# EAGLE design SparkRemoteInterface (EAGLE 6.6.0)
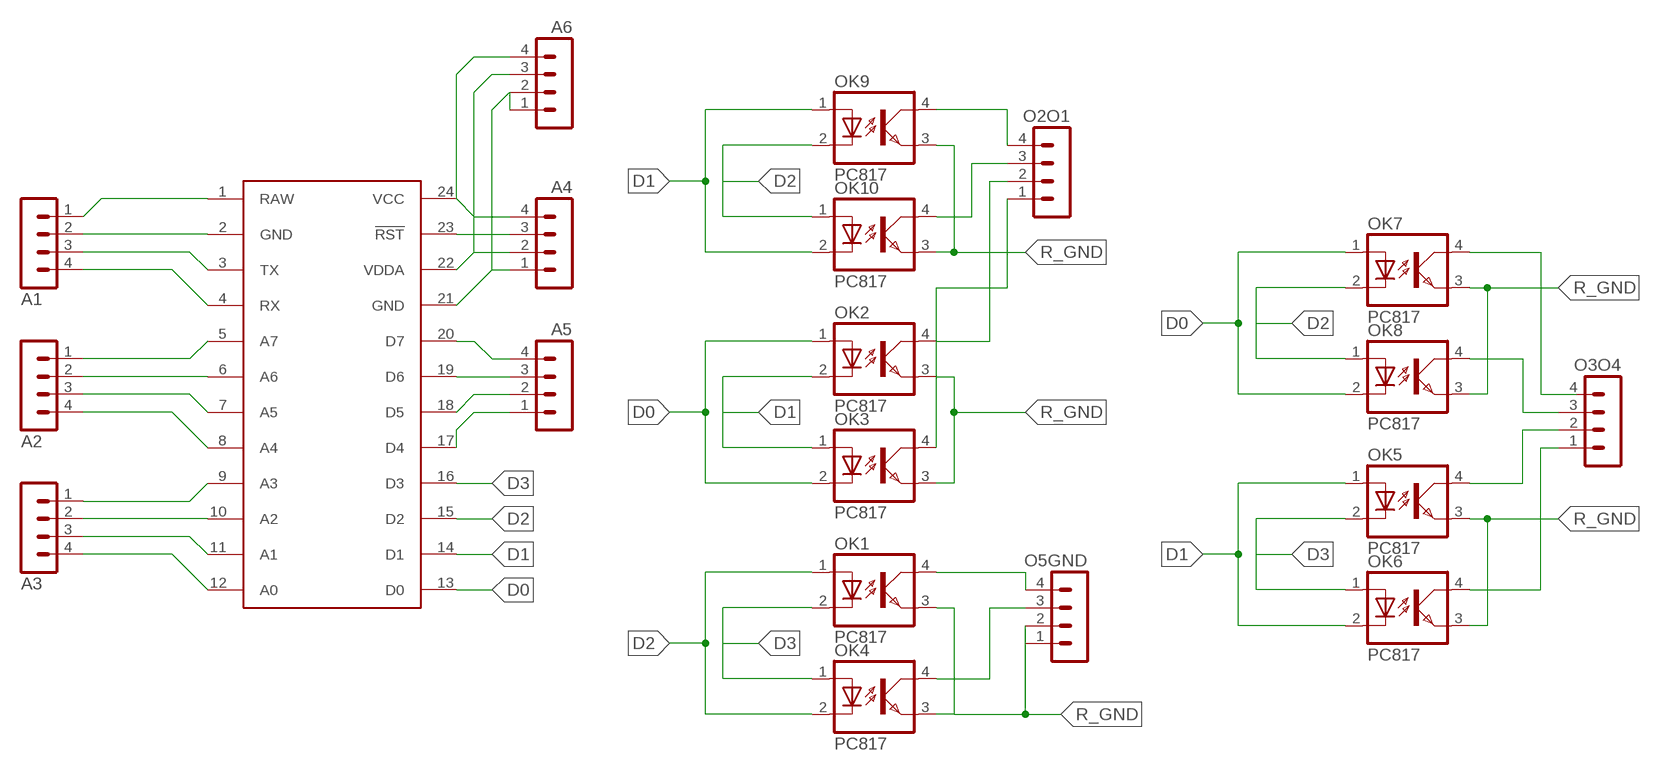
[diagram p0: schematic, sheet 1]

## Parts
A1  MA04-1  [MA04-1]
A2  MA04-1  [MA04-1]
A3  MA04-1  [MA04-1]
A4  MA04-1  [MA04-1]
A5  MA04-1  [MA04-1]
A6  MA04-1  [MA04-1]
O2O1  MA04-1  [MA04-1]
O3O4  MA04-1  [MA04-1]
O5GND  MA04-1  [MA04-1]
OK1  PC817  [DIL04]
OK2  PC817  [DIL04]
OK3  PC817  [DIL04]
OK4  PC817  [DIL04]
OK5  PC817  [DIL04]
OK6  PC817  [DIL04]
OK7  PC817  [DIL04]
OK8  PC817  [DIL04]
OK9  PC817  [DIL04]
OK10  PC817  [DIL04]
U$1  SPARK_CORECORE  [SPARK_CORE]

## Nets
1R: O2O1.2 OK2.4(COL)
1W: O2O1.1 OK3.4(COL)
2R: O2O1.4 OK9.4(COL)
2W: O2O1.3 OK10.4(COL)
3R: OK7.4(COL)
3W: O3O4.3 OK8.4(COL)
4R: O3O4.2 OK5.4(COL)
4W: O3O4.1 OK6.4(COL)
5R: O5GND.4 OK1.4(COL)
5W: O5GND.3 OK4.4(COL)
D0: OK2.1(A) OK3.2(C) OK7.1(A) OK8.2(C) U$1.13(D0)
D1: OK2.2(C) OK3.1(A) OK5.1(A) OK6.2(C) OK9.1(A) OK10.2(C) U$1.14(D1)
D2: OK1.1(A) OK4.2(C) OK7.2(C) OK8.1(A) OK9.2(C) OK10.1(A) U$1.15(D2)
D3: OK1.2(C) OK4.1(A) OK5.2(C) OK6.1(A) U$1.16(D3)
N$1: A1.1 U$1.1(RAW)
N$2: A3.1 U$1.9(A3)
N$3: A1.2 U$1.2(GND)
N$4: A1.3 U$1.3(TX)
N$5: A1.4 U$1.4(RX)
N$6: A2.1 U$1.5(A7)
N$16: A2.2 U$1.6(A6)
N$17: A2.3 U$1.7(A5)
N$18: A2.4 U$1.8(A4)
N$20: A3.2 U$1.10(A2)
N$21: A3.3 U$1.11(A1)
N$22: A3.4 U$1.12(A0)
N$23: A4.4 A6.4 U$1.24(VCC)
N$24: A4.3 U$1.23(!RST)
N$25: A4.2 A6.3 U$1.22(VDDA)
N$26: A4.1 A6.1 A6.2 U$1.21(GND)
N$27: A5.4 U$1.20(D7)
N$28: A5.3 U$1.19(D6)
N$29: A5.2 U$1.18(D5)
N$30: A5.1 U$1.17(D4)
R_GND: O5GND.1 O5GND.2 OK1.3(EMIT) OK2.3(EMIT) OK3.3(EMIT) OK4.3(EMIT) OK5.3(EMIT) OK6.3(EMIT) OK7.3(EMIT) OK8.3(EMIT) OK9.3(EMIT) OK10.3(EMIT)
Unconnected: O3O4.4

## Library data of the parts
A1-A6 O2O1 O3O4 O5GND = con-lstb:MA04-1: PIN HEADER; OC_FARNELL: unknown; OC_NEWARK: unknown
OK1-OK10 = optocoupler:PC817: SHARP OPTO COUPLER; MPN: PC817X4J000F; OC_FARNELL: 9707727; OC_NEWARK: 97K7059
U$1 = Spark:SPARK_CORE

## Net classes
0 default: width 0.305 mm, drill 0.508 mm, clearance 0.381 mm

## Board
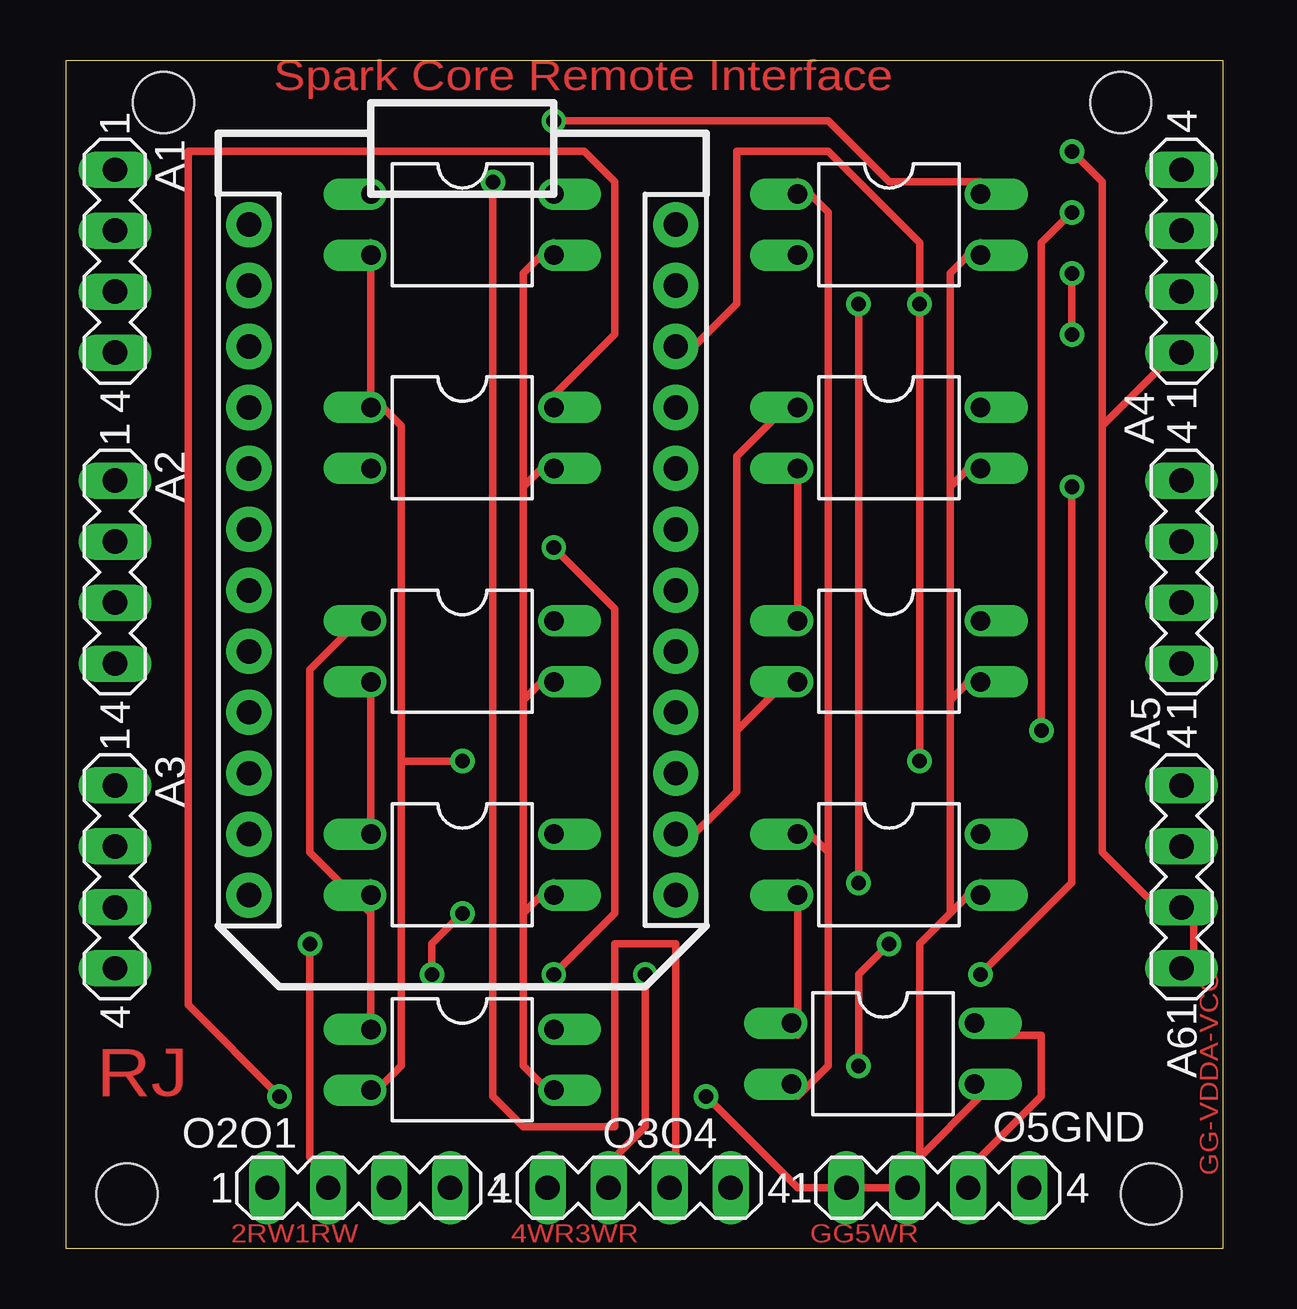
[diagram p1: board, top side]
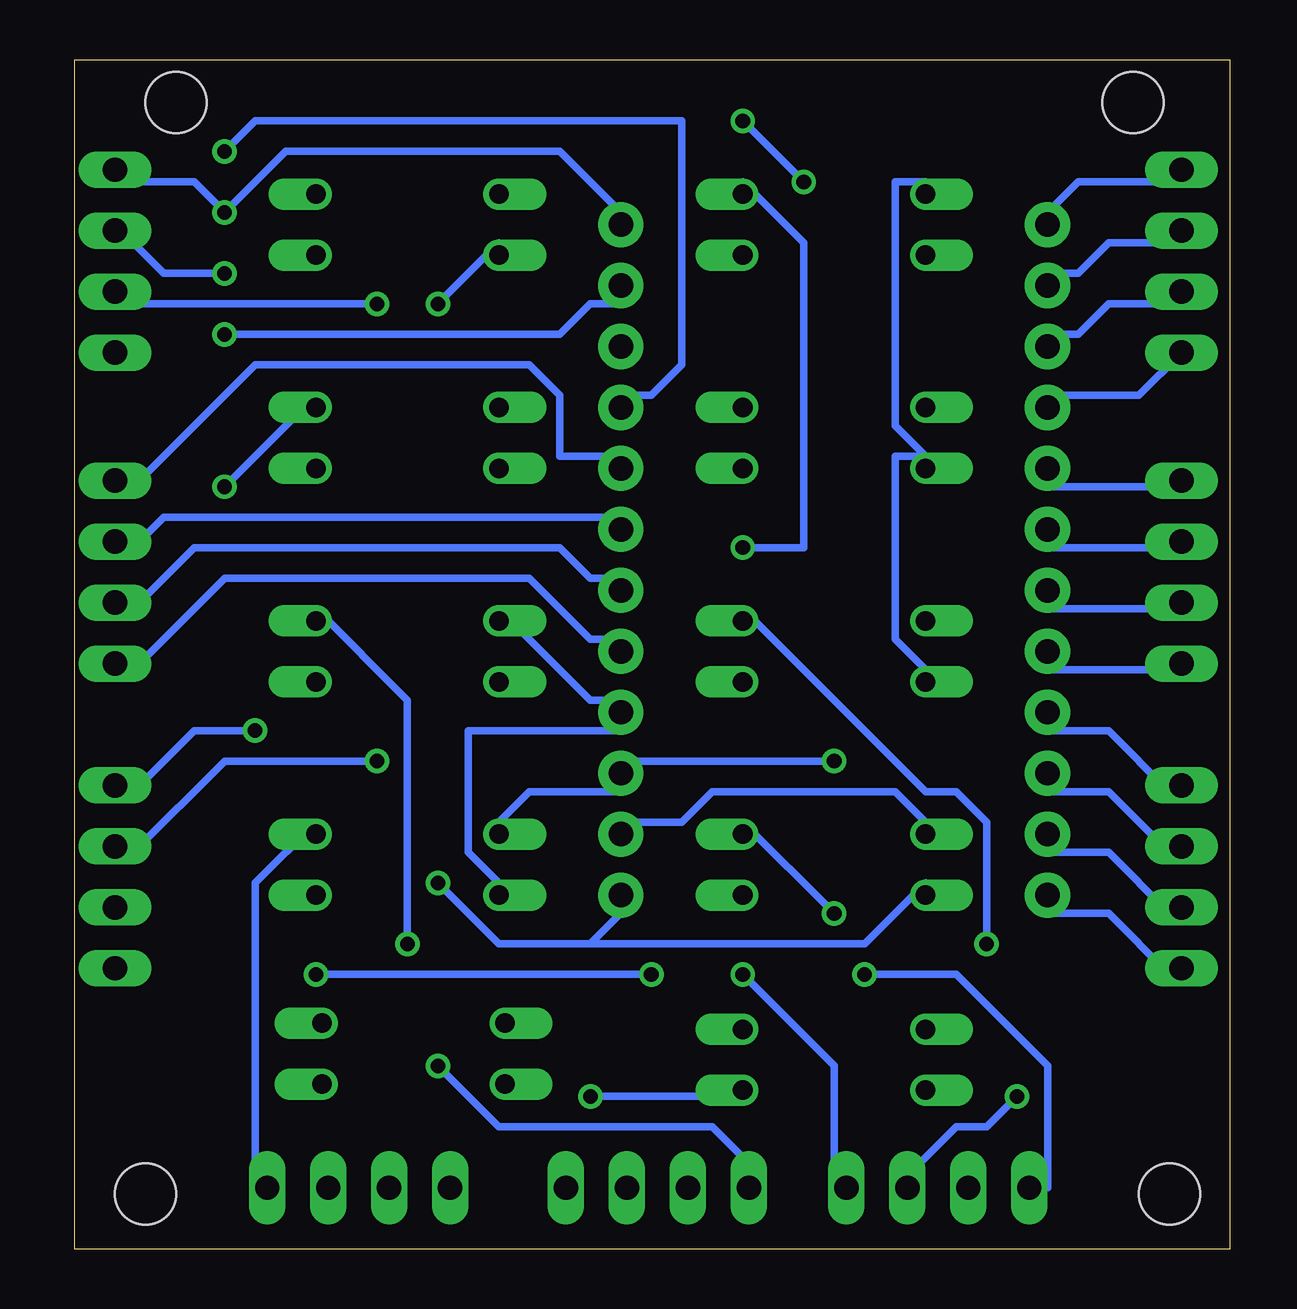
[diagram p2: board, bottom side, seen from below]

Size 48.18 x 49.54 mm. Coordinates in mm from the lower left corner, seen from the top.
Outline: 0,49.54 48.18,49.54 48.18,0 0,0 0,49.54
Copper layers (1*16): Top 0.035mm / dielectric 1.5mm / Bottom 0.035mm
Design rules "default": minimum track width 10mil, minimum drill 24mil, track to track 8mil, track to pad 8mil, pad to pad 8mil, via to via 8mil, smd to smd 8mil, copper to edge 40mil, drill to drill 8mil, minimum pad ring 10mil, minimum via ring 8mil, stop-mask expansion 4mil, vias tented up to drill 0mil, thermal gap 10mil
Holes 2.54 mm at 2.54,2.3 45.21,2.3 43.94,47.76 4.06,47.76

### Footprints (pad centres in the part's own frame; a part is rotated, then mirrored left to right if it is on the bottom)
MA04-1 = drill 1.016 long: 1 -3.81,0; 2 -1.27,0; 3 1.27,0; 4 3.81,0
DIL04 = drill 0.813 offset: 1 -1.27,-3.81; 2 1.27,-3.81; 3 1.27,3.81; 4 -1.27,3.81
SPARK_CORE = drill 1.016 pad 1.88: 1 -8.89,13.97; 2 -8.89,11.43; 3 -8.89,8.89; 4 -8.89,6.35; 5 -8.89,3.81; 6 -8.89,1.27; 7 -8.89,-1.27; 8 -8.89,-3.81; 9 -8.89,-6.35; 10 -8.89,-8.89; 11 -8.89,-11.43; 12 -8.89,-13.97; 13 8.89,-13.97; 14 8.89,-11.43; 15 8.89,-8.89; 16 8.89,-6.35; 17 8.89,-3.81; 18 8.89,-1.27; 19 8.89,1.27; 20 8.89,3.81; 21 8.89,6.35; 22 8.89,8.89; 23 8.89,11.43; 24 8.89,13.97

### Placement (x,y rotation side)
A1  2.03,41.16 270 top
A2  2.03,28.2 270 top
A3  2.03,15.5 270 top
A4  46.48,41.16 90 top
A5  46.48,28.2 90 top
A6  46.48,15.5 90 top
O2O1  12.19,2.55 0 top
O3O4  23.88,2.55 0 top
O5GND  36.32,2.55 0 top
OK1  34.29,16.01 270 top
OK2  16.51,24.9 270 top
OK3  16.51,16.01 270 top
OK4  34.04,8.14 270 top
OK5  34.29,33.79 270 top
OK6  34.29,24.9 270 top
OK7  16.51,7.88 270 top
OK8  34.29,42.68 270 top
OK9  16.51,42.68 270 top
OK10  16.51,33.79 270 top
U$1  16.51,28.71 0 top

### Tracks (layer width: path | path; a pad name or v marks a point on that pad's centre or on a via)
1R  (via drill 0.61)
  Top 0.305: v10.16,12.71 10.16,3.82 11.43,2.55 O2O1.2
  Bottom 0.305: v10.16,12.71 10.16,17.79 11.43,19.06 12.7,19.06 20.32,26.68 OK2.4
1W  (via drill 0.61)
  Top 0.305: v16.51,13.98 15.24,12.71 v15.24,11.44
  Bottom 0.305: v16.51,13.98 20.32,17.79 OK3.4 | v15.24,11.44 11.43,11.44 7.62,7.63 7.62,2.55 O2O1.1 8.89,2.55
2R  (via drill 0.61)
  Top 0.305: v20.32,29.22 22.86,26.68 22.86,13.98 v20.32,11.44
  Bottom 0.305: v20.32,29.22 17.78,29.22 17.78,41.92 20.32,44.46 OK9.4 | v20.32,11.44 16.51,7.63 16.51,2.55 O2O1.4
2W  (via drill 0.61)
  Top 0.305: v8.89,6.36 5.08,10.17 5.08,45.73 21.59,45.73 22.86,44.46 22.86,38.11 20.32,35.57 OK10.4
  Bottom 0.305: v8.89,6.36 10.16,5.09 11.43,5.09 13.97,2.55 O2O1.3
3W  (via drill 0.61)
  Top 0.305: v20.32,47 31.75,47 34.29,44.46 38.1,44.46 OK8.4 | v17.78,44.46 17.78,6.36 19.05,5.09 22.86,5.09 22.86,12.71 25.4,12.71 25.4,2.55 O3O4.3
  Bottom 0.305: v17.78,44.46 v20.32,47
4R  (via drill 0.61)
  Top 0.305: v41.91,31.76 41.91,15.25 v38.1,11.44 | v24.13,11.44 24.13,5.09 22.86,3.82 22.86,2.55 O3O4.2
  Bottom 0.305: v41.91,31.76 38.1,35.57 OK5.4 | v24.13,11.44 v38.1,11.44
4W  (via drill 0.61)
  Top 0.305: v34.29,12.71 33.02,11.44 v33.02,7.63
  Bottom 0.305: v34.29,12.71 34.29,22.87 38.1,26.68 OK6.4 | v33.02,7.63 30.48,5.09 21.59,5.09 20.32,3.82 20.32,2.55 O3O4.1
5R
  Bottom 0.305: OK1.4 38.1,17.79 40.64,15.25 40.64,2.55 O5GND.4
5W
  Top 0.305: OK4.4 38.1,8.9 40.64,8.9 40.64,6.36 38.1,3.82 38.1,2.55 O5GND.3
D0  (via drill 0.61)
  Top 0.305: 12.7,13.98 OK3.2 12.7,15.25 | 12.7,13.98 OK7.1 12.7,8.9 | 12.7,13.98 10.16,16.52 10.16,24.14 12.7,26.68 OK2.1 | v33.02,15.25 v33.02,39.38
  Bottom 0.305: v33.02,39.38 30.48,41.92 OK8.2 | v33.02,15.25 30.48,12.71 26.67,12.71 | 26.67,12.71 25.4,13.98 U$1.13 | 26.67,12.71 15.24,12.71 12.7,15.25 OK3.2
D1
  Top 0.305: 27.94,21.6 30.48,24.14 OK6.2 | 27.94,21.6 27.94,19.06 25.4,16.52 U$1.14 | 27.94,21.6 27.94,33.03 30.48,35.57 OK5.1 | OK3.1 OK2.2 12.7,24.14
  Bottom 0.305: 12.7,33.03 13.97,34.3 13.97,44.46 12.7,44.46 OK9.1 | 12.7,33.03 13.97,33.03 13.97,25.41 12.7,24.14 OK2.2 | 12.7,33.03 OK10.2 | U$1.14 25.4,17.79 22.86,17.79 21.59,19.06 13.97,19.06 12.7,17.79 OK3.1
D2  (via drill 0.61)
  Top 0.305: 13.97,20.33 13.97,34.3 12.7,35.57 | 13.97,20.33 13.97,7.63 12.7,6.36 OK7.2 | 12.7,35.57 OK9.2 12.7,41.92 | 12.7,35.57 OK10.1 | 31.75,16.52 31.75,7.63 30.48,6.36 OK4.2 | 31.75,16.52 30.48,17.79 OK1.1 | 31.75,16.52 31.75,43.19 30.48,44.46 OK8.1 | v16.51,20.33 13.97,20.33
  Bottom 0.305: OK1.1 30.48,17.79 29.21,19.06 25.4,19.06 U$1.15 25.4,20.33 v16.51,20.33
D3
  Top 0.305: OK4.1 30.48,8.9 OK1.2 30.48,15.25 | OK6.1 OK5.2 30.48,33.03
  Bottom 0.305: OK6.1 30.48,26.68 26.67,22.87 25.4,22.87 U$1.16 25.4,21.6 31.75,21.6 31.75,16.52 30.48,15.25 OK1.2
N$1
  Bottom 0.305: A1.1 2.54,44.46 6.35,44.46 7.62,43.19 U$1.1
N$2
  Bottom 0.305: A3.1 2.54,19.06 5.08,21.6 7.62,21.6 U$1.9
N$3
  Bottom 0.305: A1.2 2.54,41.92 5.08,41.92 6.35,40.65 7.62,40.65 U$1.2
N$4
  Bottom 0.305: A1.3 2.54,39.38 5.08,39.38 6.35,38.11 7.62,38.11 U$1.3
N$5
  Bottom 0.305: A1.4 3.81,35.57 7.62,35.57 U$1.4
N$6
  Bottom 0.305: A2.1 2.54,31.76 7.62,31.76 U$1.5
N$16
  Bottom 0.305: A2.2 2.54,29.22 7.62,29.22 U$1.6
N$17
  Bottom 0.305: A2.3 2.54,26.68 7.62,26.68 U$1.7
N$18
  Bottom 0.305: A2.4 2.54,24.14 7.62,24.14 U$1.8
N$20
  Bottom 0.305: A3.2 2.54,16.52 5.08,19.06 7.62,19.06 U$1.10
N$21
  Bottom 0.305: A3.3 2.54,13.98 5.08,16.52 7.62,16.52 U$1.11
N$22
  Bottom 0.305: A3.4 2.54,11.44 5.08,13.98 7.62,13.98 U$1.12
N$23  (via drill 0.61)
  Top 0.305: v40.64,21.6 40.64,41.92 v41.91,43.19
  Bottom 0.305: v40.64,21.6 43.18,21.6 45.72,19.06 A6.4 | A4.4 45.72,44.46 43.18,44.46 v41.91,43.19 39.37,45.73 27.94,45.73 25.4,43.19 U$1.24
N$24  (via drill 0.61)
  Top 0.305: v41.91,38.11 v41.91,40.65
  Bottom 0.305: v41.91,40.65 44.45,40.65 45.72,41.92 A4.3 | v41.91,38.11 27.94,38.11 26.67,39.38 25.4,39.38 U$1.23
N$25  (via drill 0.61)
  Top 0.305: v35.56,20.33 v35.56,39.38 35.56,41.92 31.75,45.73 27.94,45.73 27.94,39.38 25.4,36.84 U$1.22
  Bottom 0.305: v35.56,20.33 41.91,20.33 45.72,16.52 A6.3 | v35.56,39.38 45.72,39.38 A4.2
N$26  (via drill 0.61)
  Top 0.305: A6.1 46.99,11.44 46.99,13.98 A6.2 45.72,13.98 43.18,16.52 43.18,34.3 | 43.18,34.3 45.72,36.84 A4.1 | v41.91,45.73 43.18,44.46 43.18,34.3
  Bottom 0.305: v41.91,45.73 40.64,47 22.86,47 22.86,36.84 24.13,35.57 25.4,35.57 U$1.21
N$27
  Bottom 0.305: A5.4 45.72,31.76 40.64,36.84 29.21,36.84 27.94,35.57 27.94,33.03 25.4,33.03 U$1.20
N$28
  Bottom 0.305: A5.3 45.72,29.22 44.45,30.49 25.4,30.49 U$1.19
N$29
  Bottom 0.305: A5.2 45.72,26.68 43.18,29.22 27.94,29.22 26.67,27.95 25.4,27.95 U$1.18
N$30
  Bottom 0.305: A5.1 45.72,24.14 41.91,27.95 29.21,27.95 26.67,25.41 25.4,25.41 U$1.17
R_GND  (via drill 0.61)
  Top 0.305: 19.05,13.98 19.05,7.63 20.32,6.36 OK7.3 | 19.05,13.98 20.32,15.25 OK3.3 | 19.05,22.87 20.32,24.14 OK2.3 | 19.05,13.98 19.05,22.87 | 19.05,31.76 20.32,33.03 OK10.3 | 19.05,22.87 19.05,31.76 | 19.05,31.76 19.05,40.65 20.32,41.92 OK9.3 | 35.56,3.82 38.1,6.36 OK4.3 | 35.56,3.82 35.56,2.55 O5GND.2 | 36.83,13.98 35.56,12.71 35.56,3.82 | 36.83,13.98 38.1,15.25 OK1.3 | 35.56,3.82 O5GND.2 | 36.83,22.87 38.1,24.14 OK6.3 | 36.83,13.98 36.83,22.87 | 36.83,31.76 38.1,33.03 OK5.3 | 36.83,22.87 36.83,31.76 | 36.83,31.76 36.83,40.65 38.1,41.92 OK8.3 | O5GND.2 33.02,2.55 O5GND.1 30.48,2.55 v26.67,6.36
  Bottom 0.305: v26.67,6.36 20.32,6.36 OK7.3

### Text on the board
Top: Spark Core Remote Interface | RJ | GG-VDDA-VCC | 2RW1RW | 4WR3WR | GG5WR